# EAGLE schematic iot (EAGLE 8.6.0)
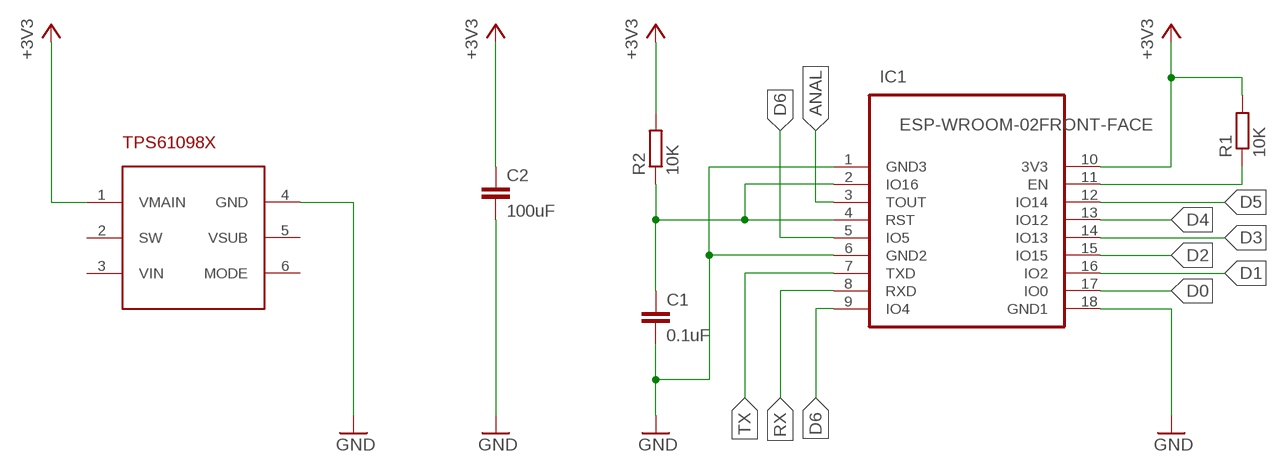
[diagram p0: schematic, sheet 1]

## Parts
C1  0.1uF  CC0603  [C0603]
C2  100uF  C  [C0805]
IC1  ESP-WROOM-02FRONT-FACE  [FRONT-FACE]
R1  10K  RR0603  [R0603]
R2  10K  RR0603  [R0603]
U$1  TPS810986  [S-PWSON-N6]

## Nets
+3V3: C2.1 IC1.10(3V3) R1.2 R2.2 U$1.1(VMAIN)
ANAL: IC1.3(TOUT)
D0: IC1.17(IO0)
D1: IC1.16(IO2)
D2: IC1.15(IO15)
D3: IC1.14(IO13)
D4: IC1.13(IO12)
D5: IC1.12(IO14)
D6: IC1.5(IO5) IC1.9(IO4)
EN: IC1.11(EN) R1.1
GND: C1.2 C2.2 IC1.1(GND3) IC1.6(GND2) IC1.18(GND1) U$1.4(GND)
N$1: C1.1 IC1.2(IO16) IC1.4(RST) R2.1
RX: IC1.8(RXD)
TX: IC1.7(TXD)
Unconnected: U$1.2(SW) U$1.3(VIN) U$1.5(VSUB) U$1.6(MODE)

## Library data of the parts
C1 C2 = eagle-ltspice:C: CAPACITOR, European symbol; SPICEMODEL: NONE; SPICEPREFIX: C
IC1 = esp-wroom-02-withbottom:ESP-WROOM-02: WiFi module - ESP-WROOM-02
R1 R2 = eagle-ltspice:R: RESISTOR, European symbol; SPICEMODEL: NONE; SPICEPREFIX: R
U$1 = TPS61098X:TPS810986